# EAGLE design ll4-gun-xmega (EAGLE 6.1)
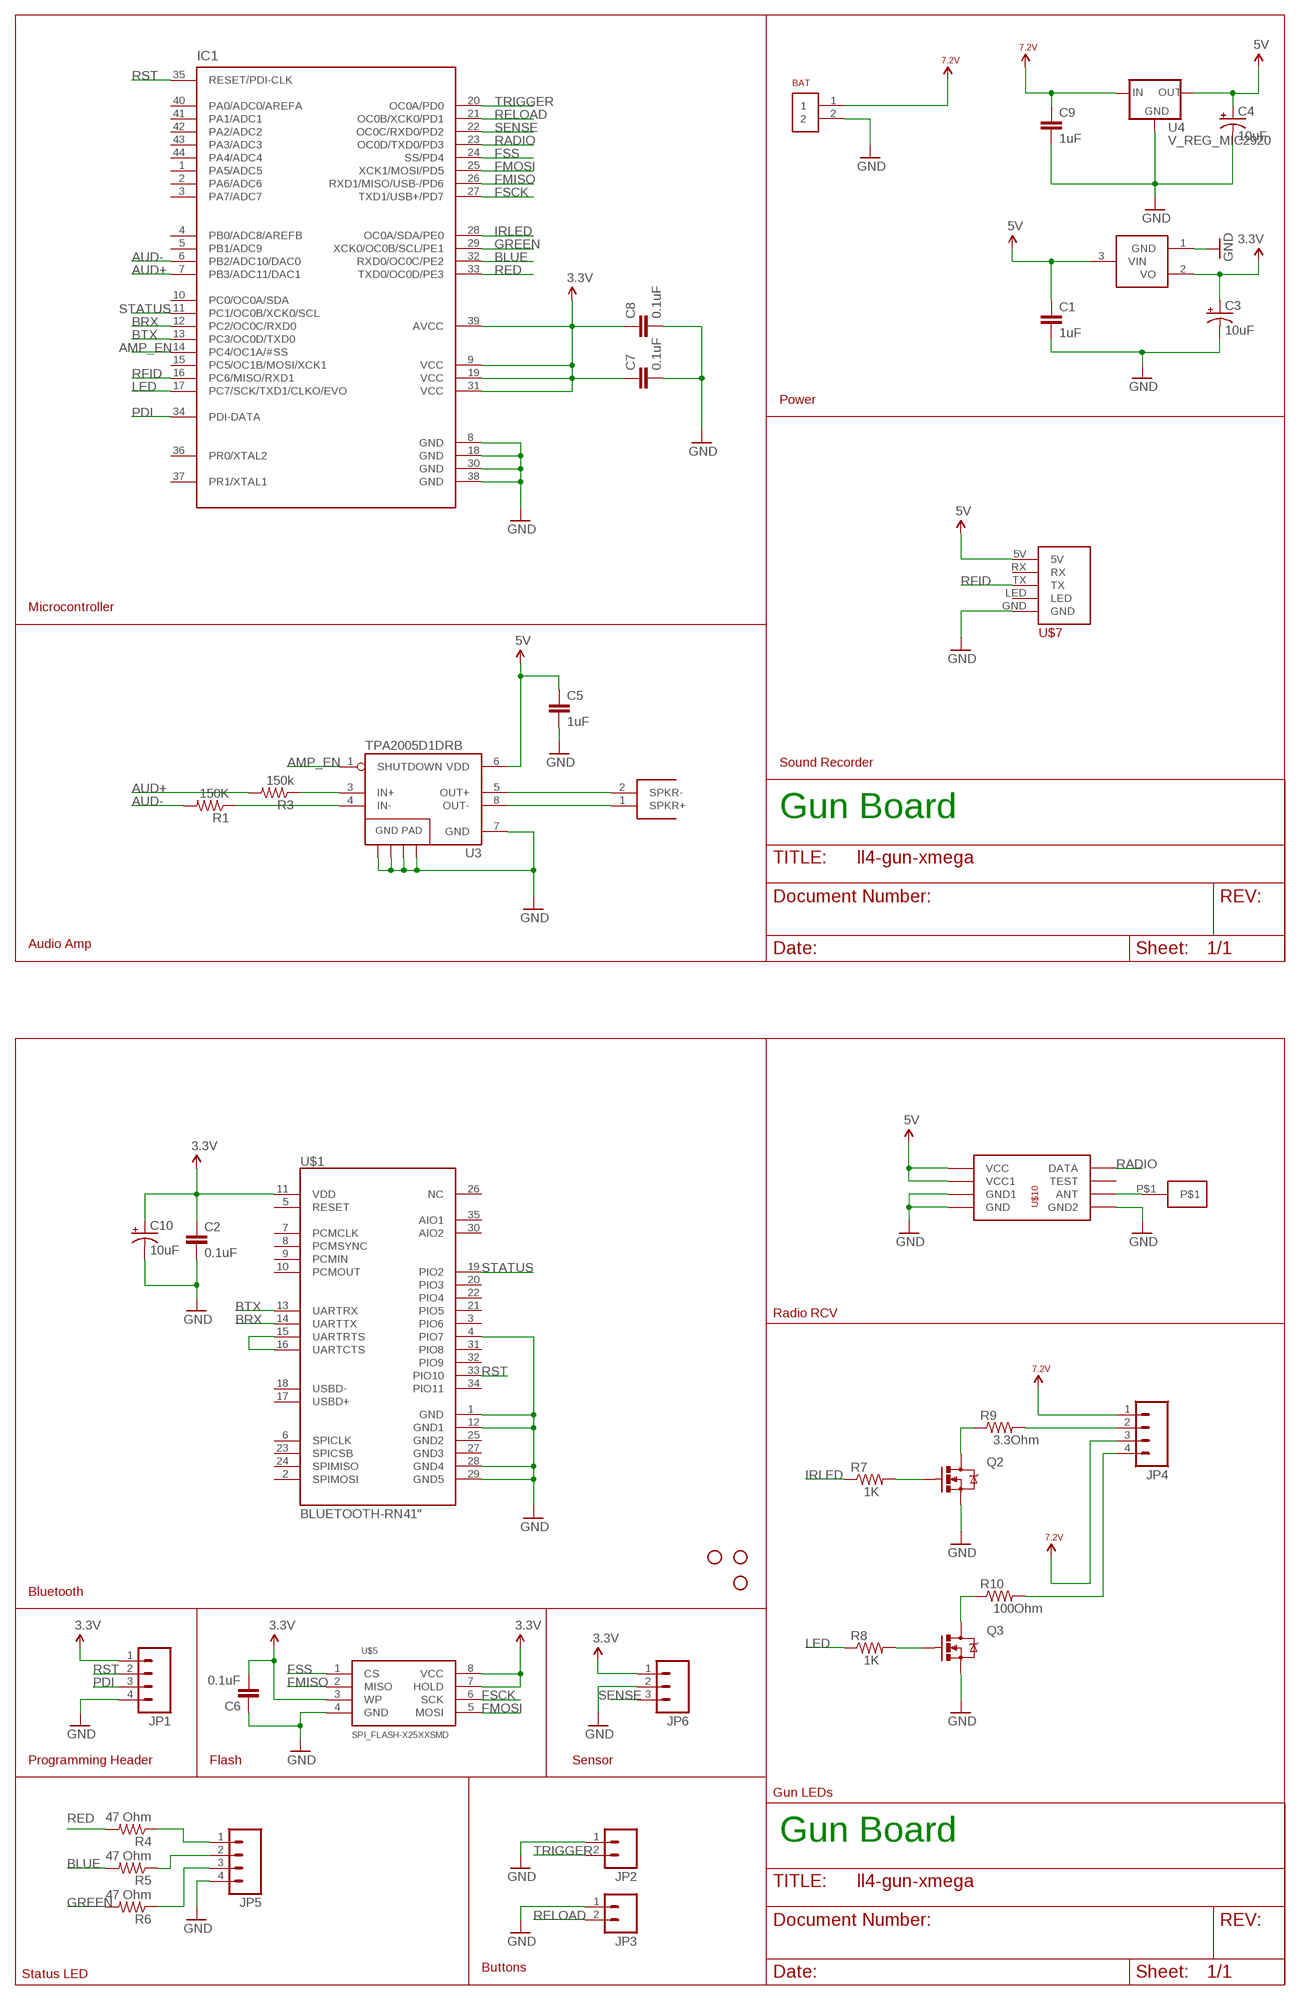
[diagram p0: schematic, sheet 1]

## Parts
BAT  2HEAD  [2HEAD]
C1  1uF  C-EUC0603  [C0603]
C2  0.1uF  C-EUC0603  [C0603]
C3  10uF  CAP_POL1206  [EIA3216]
C4  10uF  CAP_POL1206  [EIA3216]
C5  1uF  C-EUC0603  [C0603]
C6  0.1uF  C-EUC0603  [C0603]
C7  0.1uF  C-EUC0603  [C0603]
C8  0.1uF  C-EUC0603  [C0603]
C9  1uF  C-EUC0603  [C0603]
C10  10uF  CAP_POL1206  [EIA3216]
IC1  ATXMEGAXXA4U  [TQFP-44]
JP1  M04JST-PTH  [JST-4-PTH]
JP2  M02JST-PTH-2  [JST-2-PTH]
JP3  M02JST-PTH-2  [JST-2-PTH]
JP4  M04JST-PTH  [JST-4-PTH]
JP5  M04JST-PTH  [JST-4-PTH]
JP6  M03JST-PTH  [JST-3-PTH]
JP7  STAND-OFF  [STAND-OFF]
JP9  STAND-OFF  [STAND-OFF]
JP10  STAND-OFF  [STAND-OFF]
Q2  MOSFET-NCHANNELSMD  [SOT23-3]
Q3  MOSFET-NCHANNELSMD  [SOT23-3]
R1  150K  R-US_R0603  [R0603]
R3  150k  R-US_R0603  [R0603]
R4  47 Ohm  RESISTOR0805-RES  [0805]
R5  47 Ohm  RESISTOR0805-RES  [0805]
R6  47 Ohm  RESISTOR0805-RES  [0805]
R7  1K  RESISTOR0805-RES  [0805]
R8  1K  RESISTOR0805-RES  [0805]
R9  3.3Ohm  RESISTORPTH-1/2W  [AXIAL-0.5]
R10  100Ohm  RESISTORPTH-1/2W  [AXIAL-0.5]
SPEAKER  SPKRHEAD  [SPKRHEAD]
U2  VREG  [SOT23-3]
U3  TPA2005D1DRB  [QFN-8_PAD]
U4  V_REG_MIC2920  [SOT223]
U$1  BLUETOOTH-RN41"  [RN41]
U$5  SPI_FLASH-X25XXSMD  [SO08]
U$7  RFID  [RFID]
U$10  RFLINK-RCV  [RFLINK-RCV]
U$12  1HEAD  [1HEAD]

## Nets
3.3V: C2.1 C3.A(+) C6.2 C7.1 C8.1 C10.A(+) IC1.9(VCC) IC1.19(VCC) IC1.31(VCC) IC1.39(AVCC) JP1.1 JP6.1 U2.2(VO) U$1.11(VDD) U$5.3(WP) U$5.7(HOLD) U$5.8(VCC)
5V: C1.1 C4.A(+) C5.1 U2.3(VIN) U3.6(VDD) U4.3(OUT) U$7.5V U$10.VCC1(VCC) U$10.VCC(VCC1)
7.2V: BAT.1 C9.1 JP4.1 JP4.3 U4.1(IN)
AMP_EN: IC1.14(PC4/OC1A/#SS) U3.1(SHUTDOWN)
AUD+: IC1.7(PB3/ADC11/DAC1) R3.2
AUD-: IC1.6(PB2/ADC10/DAC0) R1.2
BLUE: IC1.32(RXD0/OC0C/PE2) R5.2
BRX: IC1.12(PC2/OC0C/RXD0) U$1.14(UARTTX)
BTX: IC1.13(PC3/OC0D/TXD0) U$1.13(UARTRX)
FMISO: IC1.26(RXD1/MISO/USB-/PD6) U$5.2(MISO)
FMOSI: IC1.25(XCK1/MOSI/PD5) U$5.5(MOSI)
FSCK: IC1.27(TXD1/USB+/PD7) U$5.6(SCK)
FSS: IC1.24(SS/PD4) U$5.1(CS)
GND: BAT.2 C1.2 C2.2 C3.C(-) C4.C(-) C5.2 C6.1 C7.2 C8.2 C9.2 C10.C(-) IC1.8(GND) IC1.18(GND) IC1.30(GND) IC1.38(GND) JP1.4 JP2.1 JP3.1 JP5.4 JP6.2 Q2.2(S) Q3.2(S) U2.1(GND) U3.7(GND) U3.10(GND) U3.11(GND) U3.12(GND) U3.13(GND) U4.2(GND) U$1.1(GND) U$1.4(PIO7) U$1.12(GND1) U$1.28(GND4) U$1.29(GND5) U$5.4(GND) U$7.GND U$10.GND1(GND2) U$10.GND2(GND) U$10.GND(GND1)
GREEN: IC1.29(XCK0/OC0B/SCL/PE1) R6.2
IRLED: IC1.28(OC0A/SDA/PE0) R7.1
LED: IC1.17(PC7/SCK/TXD1/CLKO/EVO) R8.1
LINK: U$1.15(UARTRTS) U$1.16(UARTCTS)
N$1: SPEAKER.2(SPKR-) U3.5(OUT+)
N$2: SPEAKER.1(SPKR+) U3.8(OUT-)
N$3: R3.1 U3.3(IN+)
N$4: R1.1 U3.4(IN-)
N$5: U$10.ANT U$12.P$1
N$6: JP4.2 R9.P$2
N$7: JP4.4 R10.P$2
N$10: JP5.1 R4.1
N$11: JP5.2 R5.1
N$12: JP5.3 R6.1
N$14: Q2.1(G) R7.2
N$15: Q3.1(G) R8.2
N$18: Q3.3(D) R10.P$1
N$20: Q2.3(D) R9.P$1
PDI: IC1.34(PDI-DATA) JP1.3
RADIO: IC1.23(OC0D/TXD0/PD3) U$10.DATA
RED: IC1.33(TXD0/OC0D/PE3) R4.2
RELOAD: IC1.21(OC0B/XCK0/PD1) JP3.2
RFID: IC1.16(PC6/MISO/RXD1) U$7.TX
RST: IC1.35(RESET/PDI-CLK) JP1.2 U$1.33(PIO10)
SENSE: IC1.22(OC0C/RXD0/PD2) JP6.3
STATUS: IC1.11(PC1/OC0B/XCK0/SCL) U$1.19(PIO2)
TRIGGER: IC1.20(OC0A/PD0) JP2.2
Unconnected: IC1.1(PA5/ADC5) IC1.2(PA6/ADC6) IC1.3(PA7/ADC7) IC1.4(PB0/ADC8/AREFB) IC1.5(PB1/ADC9) IC1.10(PC0/OC0A/SDA) IC1.15(PC5/OC1B/MOSI/XCK1) IC1.36(PR0/XTAL2) IC1.37(PR1/XTAL1) IC1.40(PA0/ADC0/AREFA) IC1.41(PA1/ADC1) IC1.42(PA2/ADC2) IC1.43(PA3/ADC3) IC1.44(PA4/ADC4) U$1.2(SPIMOSI) U$1.3(PIO6) U$1.5(RESET) U$1.6(SPICLK) U$1.7(PCMCLK) U$1.8(PCMSYNC) U$1.9(PCMIN) U$1.10(PCMOUT) U$1.17(USBD+) U$1.18(USBD-) U$1.20(PIO3) U$1.21(PIO5) U$1.22(PIO4) U$1.23(SPICSB) U$1.24(SPIMISO) U$1.25(GND2) U$1.26(NC) U$1.27(GND3) U$1.30(AIO2) U$1.31(PIO8) U$1.32(PIO9) U$1.34(PIO11) U$1.35(AIO1) U$7.LED U$7.RX U$10.TEST

## Notes on the sheet
- Power
- Microcontroller
- Sound Recorder
- Gun Board
- Audio Amp
- Radio RCV
- Bluetooth
- Programming Header | Flash | Sensor
- Gun LEDs
- Gun Board
- Buttons
- Status LED

## Library data of the parts
BAT = custom:2HEAD
C1 C2 C5-C9 = rcl:C-EU: CAPACITOR, European symbol
C3 C4 C10 = sparkfun:CAP_POL: Capacitor Polarized These are standard SMD and PTH capacitors. Normally 10uF, 47uF, and 100uF in electrolytic and tantalum varieties. Always verify the external diameter of the through hole cap, it varies with capacity, voltage, and manufacturer. The EIA devices should be standard.
IC1 = nonolith:ATXMEGAXXA4U: ATXMEGA A4U Series (XMEGA+USB)
JP1 JP4 JP5 = sparkfun:M04: Header 4 Standard 4-pin 0.1" header. Use with straight break away headers (SKU : PRT-00116), right angle break away headers (PRT-00553), swiss pins (PRT-00743), machine pins (PRT-00117), and female headers (PRT-00115). Molex polarized connector foot print use with SKU : PRT-08231 with associated crimp pins and housings. 1MM SMD Version SKU: PRT-10208
JP2 JP3 = sparkfun:M02: Header 2 Standard 2-pin 0.1" header. Use with straight break away headers (SKU : PRT-00116), right angle break away headers (PRT-00553), swiss pins (PRT-00743), machine pins (PRT-00117), and female headers (PRT-00115). Molex polarized connector foot print use with SKU : PRT-08233 with associated crimp pins and housings.
JP6 = sparkfun:M03: Header 3 Standard 3-pin 0.1" header. Use with straight break away headers (SKU : PRT-00116), right angle break away headers (PRT-00553), swiss pins (PRT-00743), machine pins (PRT-00117), and female headers (PRT-00115). Molex polarized connector foot print use with SKU : PRT-08232 with associated crimp pins and housings.
JP7 JP9 JP10 = sparkfun:STAND-OFF: Stand Off This is the mechanical footprint for a #4 phillips button head screw. Use the keepout ring to avoid running the screw head into surrounding components. SKU : PRT-00447
Q2 Q3 = sparkfun:MOSFET-NCHANNEL
R1 R3 = rcl:R-US_: RESISTOR, American symbol
R4-R10 = sparkfun:RESISTOR: Resistor Basic schematic elements and footprints for 0603, 1206, and PTH resistors.
SPEAKER = custom:SPKRHEAD
U2 = nonolith:VREG
U3 = mike-temp:TPA2005D1: 1.4W MONO CLASS-D AUDIO POWER AMPLIFIER The TPA2005D1 is a 1.4-W high efficiency filter-free class-D audio power amplifier in a BGA, QFN, or MSOP package that requires only three external components. Datasheet: http://focus.ti.com/lit/ds/symlink/tpa2005d1.pdf 1.4 W Into 8 ? From a 5V Supply at THD = 10% (Typ) Maximum Battery Life and Minimum Heat Efficiency With an 8-? Speaker: 84% at 400 mW, 79% at 100 mW 2.8-mA Quiescent Current 0.5-mA Shutdown Current Ideal for Wireless or Cellular Handsets and PDAs Capable of Driving an 8-? Speaker (2.5 V ? VDD ? 5.5 V) and a 4-? Speaker (2.5 V ? VDD ? 4.2 V) Only Three External Components Optimized PWM Output Stage Eliminates LC Output Filter Internally Generated 250-kHz Switching Frequency Eliminates Capacitor and Resistor Improved PSRR (-71 dB at 217 Hz) and Wide Supply Voltage (2.5 V to 5.5 V) Eliminates Need for a Voltage Regulator Fully Differential Design Reduces RF Rectification and Eliminates Bypass Capacitor Improved CMRR Eliminates Two Input Coupling Capacitors
U4 = sparkfun:V_REG_MIC2920: MIC2920A (http://www.micrel.com/_PDF/mic2920.pdf) - 400mA output LDO Regulator
U$1 = sparkfun:BLUETOOTH-RN41
U$5 = sparkfun:SPI_FLASH-X25XX: 8pin SPI Flash series x25xx. Works with devices like W25X32 and BR25L32
U$7 = custom:RFID
U$10 = custom:RFLINK-RCV
U$12 = custom:1HEAD

## Board
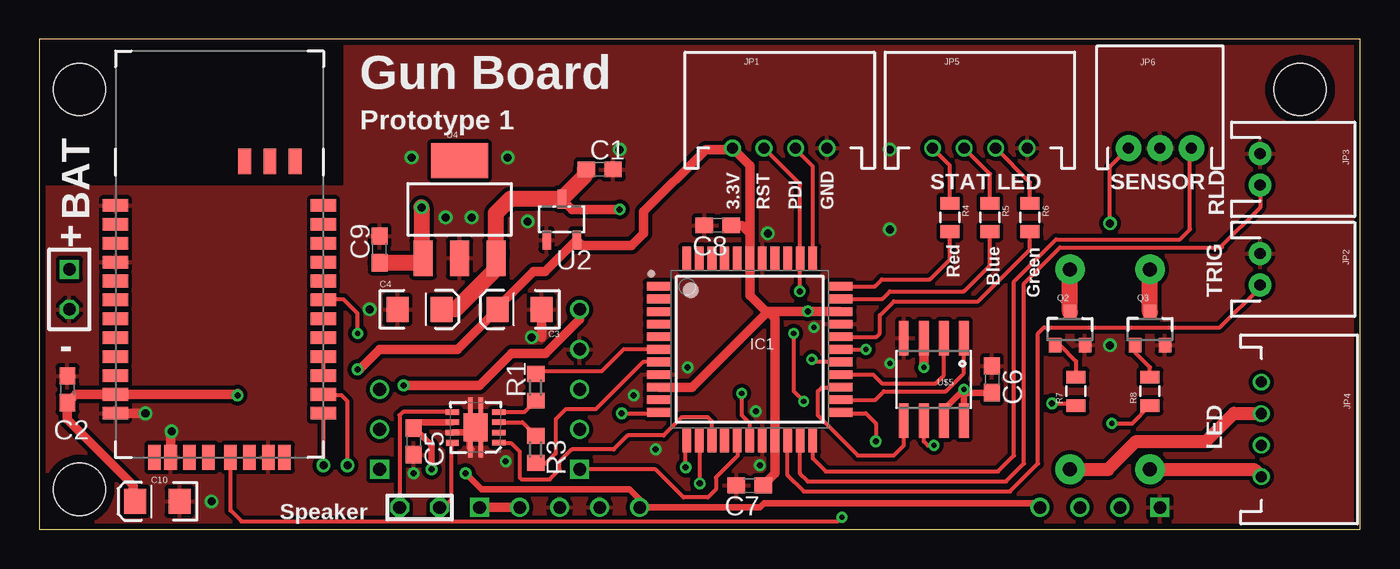
[diagram p1: board, top side]
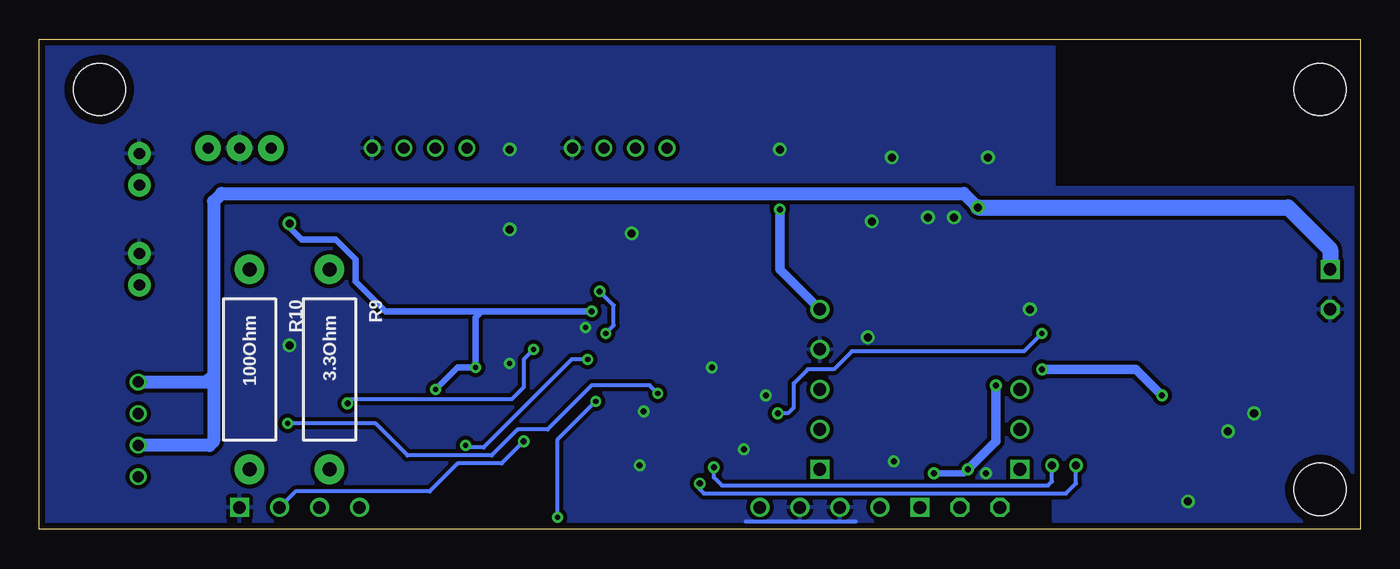
[diagram p2: board, bottom side, seen from below]

Size 83.82 x 31.11 mm. Coordinates in mm from the lower left corner, seen from the top.
Outline: 0,0 83.82,0 83.82,31.11 0,31.11 0,0
Copper layers (1*16): Top 0.0356mm / dielectric 1.5011mm / Bottom 0.0356mm
Design rules: minimum track width 6mil, minimum drill 13mil, track to track 6mil, track to pad 6mil, pad to pad 6mil, via to via 6mil, smd to smd 6mil, copper to edge 15mil, drill to drill 6mil, minimum pad ring 7mil, minimum via ring 7mil, stop-mask expansion 2mil, vias tented up to drill 20mil, thermal gap 10mil

### Footprints (pad centres in the part's own frame; a part is rotated, then mirrored left to right if it is on the bottom)
2HEAD = drill 0.8 square: 1 -1.27,0 | drill 0.8 octagon: 2 1.27,0
C0603 = smd 1.1 x 1: 1 -0.85,0; 2 0.85,0
EIA3216 = smd 1.4 x 1.6: A 1.4,0; C -1.4,0
TQFP-44 = smd 1.55 x 0.55: 1 -5.75,4; 2 -5.75,3.2; 3 -5.75,2.4; 4 -5.75,1.6; 5 -5.75,0.8; 6 -5.75,0; 7 -5.75,-0.8; 8 -5.75,-1.6; 9 -5.75,-2.4; 10 -5.75,-3.2; 11 -5.75,-4; 23 5.75,-4; 24 5.75,-3.2; 25 5.75,-2.4; 26 5.75,-1.6; 27 5.75,-0.8; 28 5.75,0; 29 5.75,0.8; 30 5.75,1.6; 31 5.75,2.4; 32 5.75,3.2; 33 5.75,4 | smd 0.55 x 1.55: 12 -4,-5.75; 13 -3.2,-5.75; 14 -2.4,-5.75; 15 -1.6,-5.75; 16 -0.8,-5.75; 17 0,-5.75; 18 0.8,-5.75; 19 1.6,-5.75; 20 2.4,-5.75; 21 3.2,-5.75; 22 4,-5.75; 34 4,5.75; 35 3.2,5.75; 36 2.4,5.75; 37 1.6,5.75; 38 0.8,5.75; 39 0,5.75; 40 -0.8,5.75; 41 -1.6,5.75; 42 -2.4,5.75; 43 -3.2,5.75; 44 -4,5.75
JST-4-PTH = drill 0.7: 1 -3,-5; 2 -1,-5; 3 1,-5; 4 3,-5
JST-2-PTH = drill 0.7 pad 1.448: 1 -1,0; 2 1,0
JST-3-PTH = drill 0.7 pad 1.626: 1 -2,-5; 2 0,-5; 3 2,-5
STAND-OFF = hole 3.302: 0,0
SOT23-3 = smd 0.8 x 0.9: 1 -0.95,-1; 2 0.95,-1; 3 0,1.1
R0603 = smd 1 x 1.1: 1 -0.85,0; 2 0.85,0
0805 = smd 0.8 x 1.2: 1 -0.9,0; 2 0.9,0
AXIAL-0.5 = drill 0.9 pad 1.88: P$1 -6.35,0; P$2 6.35,0
SPKRHEAD = drill 0.8 octagon: 1 -1.27,0; 2 1.27,0
SOT23-3' = smd 0.55 x 1.2: 1 0.95,1.3; 2 -0.95,1.3; 3 0,-1.3
QFN-8_PAD = smd 0.35 x 0.85: 1 -0.975,-1.475; 2 -0.325,-1.475; 3 0.325,-1.475; 4 0.975,-1.475; 5 0.975,1.475; 6 0.325,1.475; 7 -0.325,1.475; 8 -0.975,1.475 | smd 1.75 x 1.5: 9 0,0 | smd 1.025 x 0.28: 10 -1.387,-0.325; 11 1.387,-0.325; 12 1.387,0.325; 13 -1.387,0.325
SOT223 = smd 1.219 x 2.235: 1 -2.311,-3.099; 2 0,-3.099; 3 2.311,-3.099 | smd 3.6 x 2.2: 4 0,3.099
RN41 = smd 0.8 x 1.6: 1 -6.6,-6.6; 2 -5.4,-6.6; 3 -4.2,-6.6; 4 -3,-6.6; 5 -1.8,-6.6; 6 -0.6,-6.6; 7 0.6,-6.6; 8 1.8,-6.6; 9 3,-6.6; 10 4.2,-6.6; 11 5.4,-6.6; 12 6.6,-6.6; 13 6.6,6.6; 14 5.4,6.6; 15 4.2,6.6; 16 3,6.6; 17 1.8,6.6; 18 0.6,6.6; 19 -0.6,6.6; 20 -1.8,6.6; 21 -3,6.6; 22 -4.2,6.6; 23 -5.4,6.6; 24 -6.6,6.6 | smd 1.6 x 0.8: 25 -9.4,4.8; 26 -9.4,3.2; 27 -9.4,1.6; 28 9.4,3.1; 29 9.4,-3.1; 30 9.4,-4.122; 31 9.4,-1.9; 32 9.4,-0.7; 33 9.4,0.7; 34 9.4,1.9; 35 9.4,4.122
SO08 = smd 0.61 x 2.21: 1 -1.905,-2.616; 2 -0.635,-2.616; 3 0.635,-2.616; 4 1.905,-2.616; 5 1.905,2.616; 6 0.635,2.616; 7 -0.635,2.616; 8 -1.905,2.616
RFID = drill 0.8: 5V -10.16,0; GND -7.62,0; P$5 -2.54,-12.7; P$6 -5.08,-12.7; P$8 -5.08,0; RX -2.54,0 | drill 0.8 square: LED 0,-12.7; TX 0,0
RFLINK-RCV = drill 0.8: ANT 21.59,0; DATA -16.51,0; GND1 16.51,0; GND2 19.05,0; TEST -13.97,0; VCC -11.43,0; VCC1 13.97,0 | drill 0.8 square: GND -19.05,0
1HEAD = drill 0.8 square: P$1 0,0

### Placement (x,y rotation side)
BAT  1.91,15.24 270 top
C1  35.56,22.86 0 top
C2  1.78,8.89 90 top
C3  30.48,13.97 180 top
C4  24.13,13.97 0 top
C5  23.75,5.59 270 top
C6  60.45,9.53 270 top
C7  45.09,2.79 180 top
C8  43.05,19.3 180 top
C9  21.59,17.78 90 top
C10  7.49,1.78 180 top
IC1  45.09,11.43 0 top
JP1  46.99,29.21 0 top
JP2  77.47,16.51 270 top
JP3  77.47,22.86 270 top
JP4  82.55,6.35 270 top
JP5  59.69,29.21 0 top
JP6  71.12,29.21 0 top
JP7  80.01,27.94 0 top
JP9  2.54,27.94 0 top
JP10  2.54,2.54 0 top
Q2  65.41,12.7 0 top
Q3  70.48,12.7 0 top
R1  31.5,9.02 90 top
R3  31.5,5.08 270 top
R4  57.78,19.81 270 top
R5  60.33,19.81 270 top
R6  62.87,19.81 270 top
R7  65.79,8.76 90 top
R8  70.48,8.76 90 top
R9  65.41,10.16 270 bottom
R10  70.48,10.16 270 bottom
SPEAKER  24.13,1.4 180 top
U2  VREG  [SOT23-3']  33.15,19.68 180 top
U3  27.69,6.48 90 top
U4  26.67,20.32 0 top
U$1  11.43,13.97 270 top
U$5  56.77,9.53 180 top
U$7  34.29,3.81 270 top
U$10  52.07,1.4 0 bottom
U$12  27.94,1.4 0 top

### Tracks (layer width: path | path; a pad name or v marks a point on that pad's centre or on a via)
3.3V  (via drill 0.33, 0.38, 0.51)
  Top 0.254: 50.82,13.84 IC1.31 | 34.16,18.03 34.19,18.03 U2.2 | v67.94,19.43 67.94,23.04 JP6.1 | 5.97,1.91 5.97,1.9
  Top 0.406: v58.67,8.89 U$5.8 | v58.67,8.89 57.4,7.62 | C6.2 58.89,8.68 v58.67,8.89
  Top 0.61: 45.09,18.8 45.09,23.11 JP1.1 43.91,24.13 42.29,24.13 38.35,20.19 38.35,18.8 37.59,18.03 34.45,18.03 U2.2 32.09,16.38 31.37,16.38 29.08,14.09 C3.A 26.54,11.43 21.59,11.43 20.32,10.16 v20.19,10.16 | 45.09,18.8 IC1.39 45.09,14.86 46.1,13.84 46.23,13.84 | 46.23,13.84 46.69,13.39 IC1.19 46.69,3.54 C7.1 | IC1.9 41.41,9.03 46.23,13.84 | v56.13,10.29 U$5.3 | 46.23,13.84 v48.77,13.84 50.82,13.84 | C10.A 5.97,1.9 | 57.4,7.62 U$5.7 | 12.57,8.64 v12.57,8.51 12.63,8.57 U$1.11 2.31,8.57 C2.1 1.78,6.99 5.97,2.79 5.97,1.91 5.97,1.78 | C8.1 44.58,19.3 45.09,18.8
  Bottom 0.406: 55.75,13.84 61.85,13.84 63.75,15.75 63.75,17.14 65.02,18.41 67.18,18.41 67.94,19.18 v67.94,19.43 | 55.75,13.84 56.13,13.46 v56.13,10.29 57.28,10.29 v58.67,8.89 | v48.77,13.84 55.75,13.84
  Bottom 0.61: v20.19,10.16 14.22,10.16 v12.57,8.51
5V  (via drill 0.38)
  Top 0.254: 23.75,6.35 C5.1 23.79,6.44 23.81,6.41 | U$7.5V 34.29,13.84
  Top 0.406: U$10.VCC 63.25,1.65 45.97,1.65 45.72,1.4 U$10.VCC1 38.1,1.91 37.47,2.54 28.07,2.54 v27.05,3.56 | U3.6 24.2,6.8 23.81,6.41 | 23.81,6.41 23.75,6.35 | 23.81,6.41 24.89,5.33 v24.89,3.81 | 23.81,6.41 23.75,6.48
  Top 0.61: 34.61,22.86 C1.1 | 36.86,20.29 v36.83,20.32 33.81,20.32 U2.3 | 34.29,13.84 34.29,13.34 32.13,11.18 29.97,11.18 27.94,9.14 v23.11,9.14
  Top 1.016: C4.A 26.42,13.97 28.98,16.54 U4.3 29.08,17.32 29.08,17.65 28.96,17.78 28.96,20.07 29.88,20.98 U2.3 34.61,22.45 34.61,22.86
  Bottom 0.406: v27.05,3.56 25.15,3.56 v24.89,3.81
  Bottom 0.61: v36.83,20.32 36.83,16.51 U$7.5V | v23.11,9.14 23.11,5.59 v24.89,3.81
7.2V  (via drill 0.51)
  Top 1.016: v24.26,20.45 24.26,17.4 24.38,17.27 24.38,17.25 U4.1 24.07,16.93 C9.1
  Bottom 0.813: 72.77,9.78 72.77,20.83 72.26,21.34 25.15,21.34 v24.26,20.45 | 72.77,9.78 72.77,5.59 73.03,5.33 77.53,5.33 JP4.3 | JP4.1 73.2,9.35 72.77,9.78
  Bottom 1.016: v24.26,20.45 4.57,20.45 1.91,17.78 BAT.1
AMP_EN
  Top 0.254: 29.21,5.46 29.97,5.46 30.48,4.95 30.48,3.3 30.61,3.17 32.38,3.17 33.02,3.81 33.02,4.32 33.78,5.08 36.45,5.08 37.34,5.97 39.62,5.97 40.77,7.11 42.42,7.11 42.67,6.86 42.67,5.67 IC1.14 | 29.08,5.46 29.21,5.46 | U3.1 29.21,5.46
AUD+
  Top 0.254: R3.2 31.54,4.19 32.13,4.19 32.77,4.83 32.77,6.99 33.4,7.62 35.31,7.62 38.32,10.63 IC1.7
AUD-
  Top 0.254: IC1.6 37.08,11.43 35.69,10.03 31.66,10.03 R1.2
BLUE
  Top 0.254: IC1.32 53.49,14.63 53.98,15.11 58.67,15.11 60.33,16.76 R5.2
BRX  (via drill 0.38, 0.51)
  Top 0.254: 41.15,5.62 IC1.12 41.02,5.62 v41.02,3.94 | v19.56,4.06 19.56,8.13 19.18,8.51 18.09,8.51 U$1.14
  Bottom 0.254: v19.56,4.06 19.56,3.05 19.81,2.79 40.51,2.79 41.02,3.3 v41.02,3.94
BTX  (via drill 0.38, 0.51)
  Top 0.254: v41.91,2.92 41.91,5.66 IC1.13 | v18.03,4.06 18.03,7.11 18.03,7.12 U$1.13
  Bottom 0.254: v18.03,4.06 18.03,2.92 18.67,2.29 41.66,2.29 41.91,2.54 v41.91,2.92
FMISO
  Top 0.254: IC1.26 52.91,9.83 53.47,9.27 56.9,9.27 57.4,9.78 U$5.2
FMOSI
  Top 0.254: IC1.25 49.67,9.03 49.4,8.76 49.4,7.24 51.94,4.7 54.23,4.7 54.86,5.33 U$5.5
FSCK  (via drill 0.33)
  Top 0.254: IC1.27 49.19,10.63 v49.02,10.79 | v56.77,5.33 56.39,5.33 56.13,5.59 U$5.6
  Bottom 0.254: v49.02,10.79 50.04,10.79 55.63,5.21 56.64,5.21 v56.77,5.33
FSS
  Top 0.254: IC1.24 53.06,8.23 53.59,8.76 57.53,8.76 58.67,9.91 U$5.1
GND  (via drill 0.33, 0.38, 0.51)
  Top 0.406: U3.7 27.25,6.15 | 27.3,6.1 27.3,5.21 27.42,5.09 | U3.13 27.42,5.09 | 27.42,5.09 27.43,5.08
  Top 0.61: 31.88,12.2 C3.C | U$1.12 v6.73,7.37 | U$1.29 8.33,5.92 v8.38,6.22 | 27.25,6.15 27.3,6.1
  Bottom 0.254: 38.99,0.51 32,0.51
  Bottom 0.61: v6.73,7.37 6.86,7.37 | v8.38,6.22 8.38,6.1
  other vias: 20.95,13.97 31.24,12.19 36.83,24.13 27.43,19.81 53.98,10.54 49.15,12.83 45.72,4.06 41.15,10.29 45.47,7.49 46.23,18.8 10.92,1.78 53.98,19.05 53.98,24.13 67.94,11.68 23.75,3.56 37.72,8.51 39.12,5.08 29.59,4.32 23.62,23.62 29.72,23.62 25.78,19.81 30.99,19.56
  pour Bottom (isolate 0.254): 19.43,31.11 83.95,31.11 83.95,0 19.43,0
  pour Top (isolate 0.254): 19.43,31.11 84.45,31.11 84.45,0 19.43,0
  pour Top (isolate 0.254): 19.43,21.72 0,21.72 0,0.13 2.41,0 19.56,0 19.56,21.59
  pour Bottom (isolate 0.254): 19.3,21.72 -0.76,21.72 -0.76,0.51 19.43,0.51 19.43,21.59
GREEN
  Top 0.254: IC1.29 53.12,12.23 53.34,12.45 53.34,13.59 54.23,14.48 59.56,14.48 62.87,17.78 R6.2
IRLED  (via drill 0.33, 0.38)
  Top 0.254: IC1.28 v52.45,11.43 | v64.26,8 65.65,8 R7.1
  Bottom 0.254: v64.26,8 64.01,8.26 53.85,8.26 53.09,9.02 53.09,10.79 v52.45,11.43
LED  (via drill 0.33)
  Top 0.254: v44.58,8.64 44.58,7.24 45.09,6.73 IC1.17 | v68.07,6.73 69.35,6.73 R8.1
  Bottom 0.254: v68.07,6.73 62.48,6.73 60.45,4.7 55.12,4.7 53.47,6.35 51.56,6.35 48.77,9.14 45.09,9.14 v44.58,8.64
LINK
  Top 0.254: U$1.15 U$1.16
N$1
  Top 0.254: SPEAKER.2 22.86,7.24 23.07,7.45 U3.5
N$2
  Top 0.254: SPEAKER.1 25.65,1.4 26.16,1.91 26.16,5.33 26.29,5.46 26.25,5.46 U3.8
N$3
  Top 0.254: U3.3 30.66,6.8 31.5,5.97 R3.1
N$4
  Top 0.254: U3.4 30.78,7.45 R1.1
N$5
  Top 0.61: U$10.ANT U$12.P$1
N$6
  Top 0.254: 77.6,7.37 77.57,7.37 JP4.2
  Top 0.813: R9.P$2 67.82,3.81 69.6,5.59 74.04,5.59 75.82,7.37 77.6,7.37
N$7
  Top 0.813: R10.P$2 77.09,3.81 JP4.4
N$10
  Top 0.254: R4.1 57.78,23.11 JP5.1
N$11
  Top 0.254: R5.1 60.33,22.57 JP5.2
N$12
  Top 0.254: R6.1 62.87,22.04 JP5.3
N$14
  Top 0.254: Q2.1 64.75,11.7 65.79,10.67 R7.2
N$15
  Top 0.254: R8.2 70.48,10.29 69.53,11.24 Q3.1
N$18
  Top 1.016: Q3.3 R10.P$1
N$20
  Top 1.016: Q2.3 R9.P$1
PDI
  Top 0.254: IC1.34 49.09,23.05 48.01,24.13 48.01,24.19 JP1.3
RADIO  (via drill 0.38)
  Top 0.254: v53.09,5.59 53.09,6.73 52.45,7.37 50.9,7.37 IC1.23
  Bottom 0.254: v53.09,5.59 54.48,4.19 57.28,4.19 59.05,2.41 67.56,2.41 U$10.DATA
RED
  Top 0.254: IC1.33 53.02,15.43 53.47,15.88 56.52,15.88 57.78,17.14 R4.2
RELOAD
  Top 0.254: IC1.21 48.28,3.53 48.77,3.05 61.34,3.05 62.48,4.19 62.48,15.62 64.77,17.91 74.93,17.91 | 74.93,17.91 75.06,17.91 | JP3.2 77.47,20.45 74.93,17.91
RFID
  Top 0.254: U$7.TX 39.12,3.81 40.89,2.03 42.42,2.03 42.93,2.54 42.93,3.3 44.32,4.7 44.32,5.46 44.2,5.59 IC1.16
RST  (via drill 0.33, 0.38)
  Top 0.254: U$1.33 12.13,1.21 12.83,0.51 50.67,0.51 v50.93,0.76 | v48.26,15.11 48.26,17.16 IC1.35 48.28,21.91 JP1.2 | v47.88,12.45 47.88,8.76 v48.51,8.13
  Bottom 0.254: v50.93,0.76 50.93,5.71 v48.51,8.13 | v48.26,15.11 47.37,14.22 47.37,12.95 v47.88,12.45
SENSE
  Top 0.254: IC1.22 49.09,4.51 49.91,3.68 60.83,3.68 61.85,4.7 61.85,15.75 64.52,18.41 72.39,18.41 73.03,19.05 73.03,24.11 JP6.3
STATUS  (via drill 0.33, 0.38)
  Top 0.254: v20.19,12.45 20.19,13.72 19.3,14.61 18.07,14.61 U$1.19 | v36.96,7.37 39.27,7.37
  Top 0.406: 39.27,7.37 IC1.11
  Bottom 0.254: v20.19,12.45 21.34,11.3 32.26,11.3 33.4,10.16 35.05,10.16 35.94,9.27 35.94,7.75 36.32,7.37 v36.96,7.37
TRIGGER
  Top 0.254: IC1.20 47.48,3.44 48.51,2.41 61.59,2.41 63.37,4.19 63.37,12.45 63.75,12.83 74.93,12.83 77.47,15.37 JP2.2

### Text on the board
tPlace: Gun Board | Prototype 1 | STAT LED | SENSOR | BAT | 3.3V | RST | PDI | GND | RLD | + | Red | Blue | Green | TRIG | - | LED | Speaker
Name: USB | Spk | Mic | IR LED | Bat | Trig | Rld | LED | GUN BRD | V1